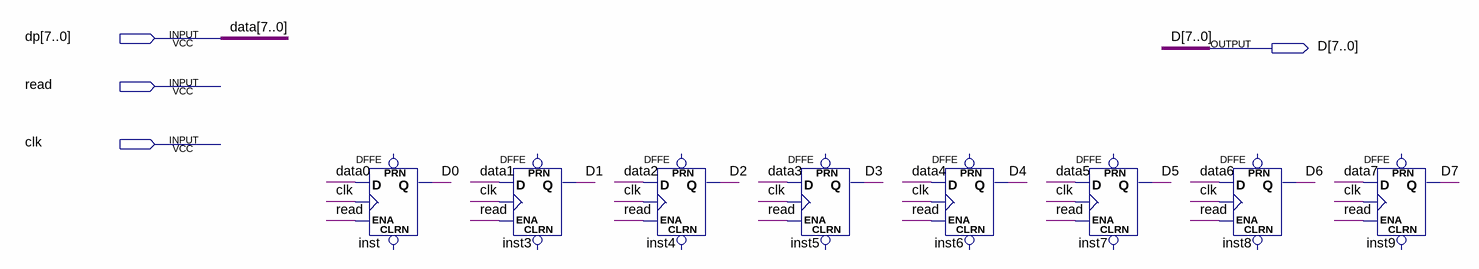
[diagram p0: schematic sheet]
// Quartus schematic REG8_LD.bdf as structural Verilog: 8 symbols, 4 pins
module REG8_LD (
  input  [7:0] dp,
  input  read,
  input  clk,
  output [7:0] D
);

  DFFE inst (.D(dp[0]), .CLK(clk), .ENA(read), .Q(D[0]));  // open: PRN, CLRN
  DFFE inst3 (.D(dp[1]), .CLK(clk), .ENA(read), .Q(D[1]));  // open: PRN, CLRN
  DFFE inst4 (.D(dp[2]), .CLK(clk), .ENA(read), .Q(D[2]));  // open: PRN, CLRN
  DFFE inst5 (.D(dp[3]), .CLK(clk), .ENA(read), .Q(D[3]));  // open: PRN, CLRN
  DFFE inst6 (.D(dp[4]), .CLK(clk), .ENA(read), .Q(D[4]));  // open: PRN, CLRN
  DFFE inst7 (.D(dp[5]), .CLK(clk), .ENA(read), .Q(D[5]));  // open: PRN, CLRN
  DFFE inst8 (.D(dp[6]), .CLK(clk), .ENA(read), .Q(D[6]));  // open: PRN, CLRN
  DFFE inst9 (.D(dp[7]), .CLK(clk), .ENA(read), .Q(D[7]));  // open: PRN, CLRN

  // Other names for the same wires on the sheet: data[7:0] = dp; data0 = dp[0]; data1 = dp[1]; data2 = dp[2];
  //   data3 = dp[3]; data4 = dp[4]; data5 = dp[5]; data6 = dp[6]; data7 = dp[7]
endmodule
